# EasyEDA Pro project ProPrj_初级项目_2026-01-11.epro, board PCB2
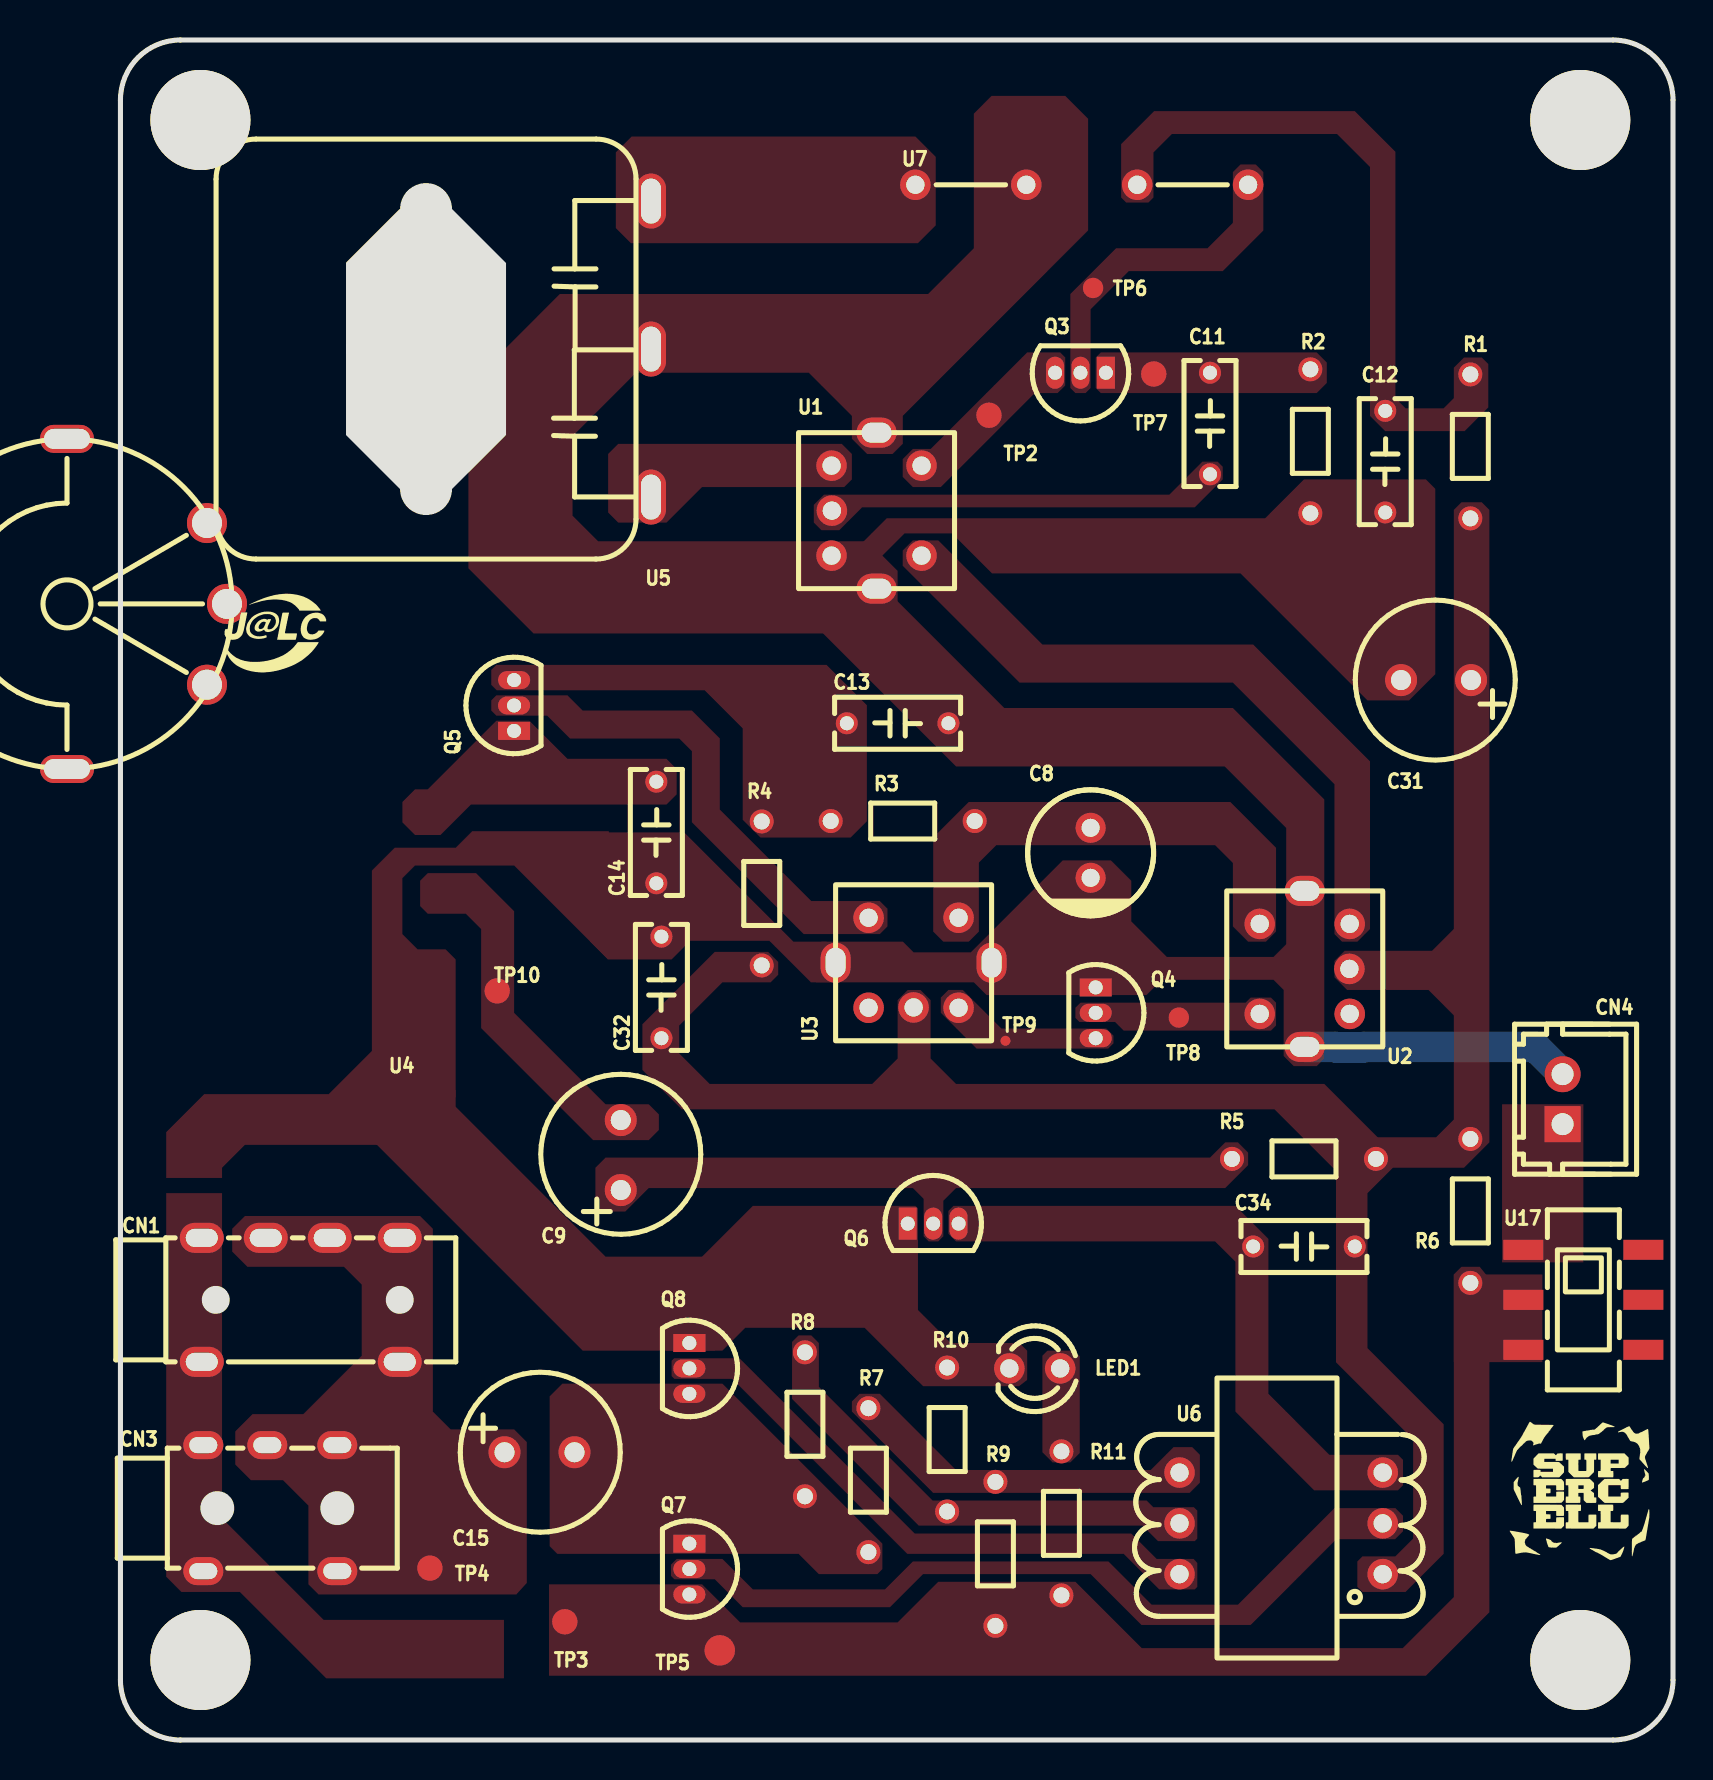
[diagram p6: board, top side]
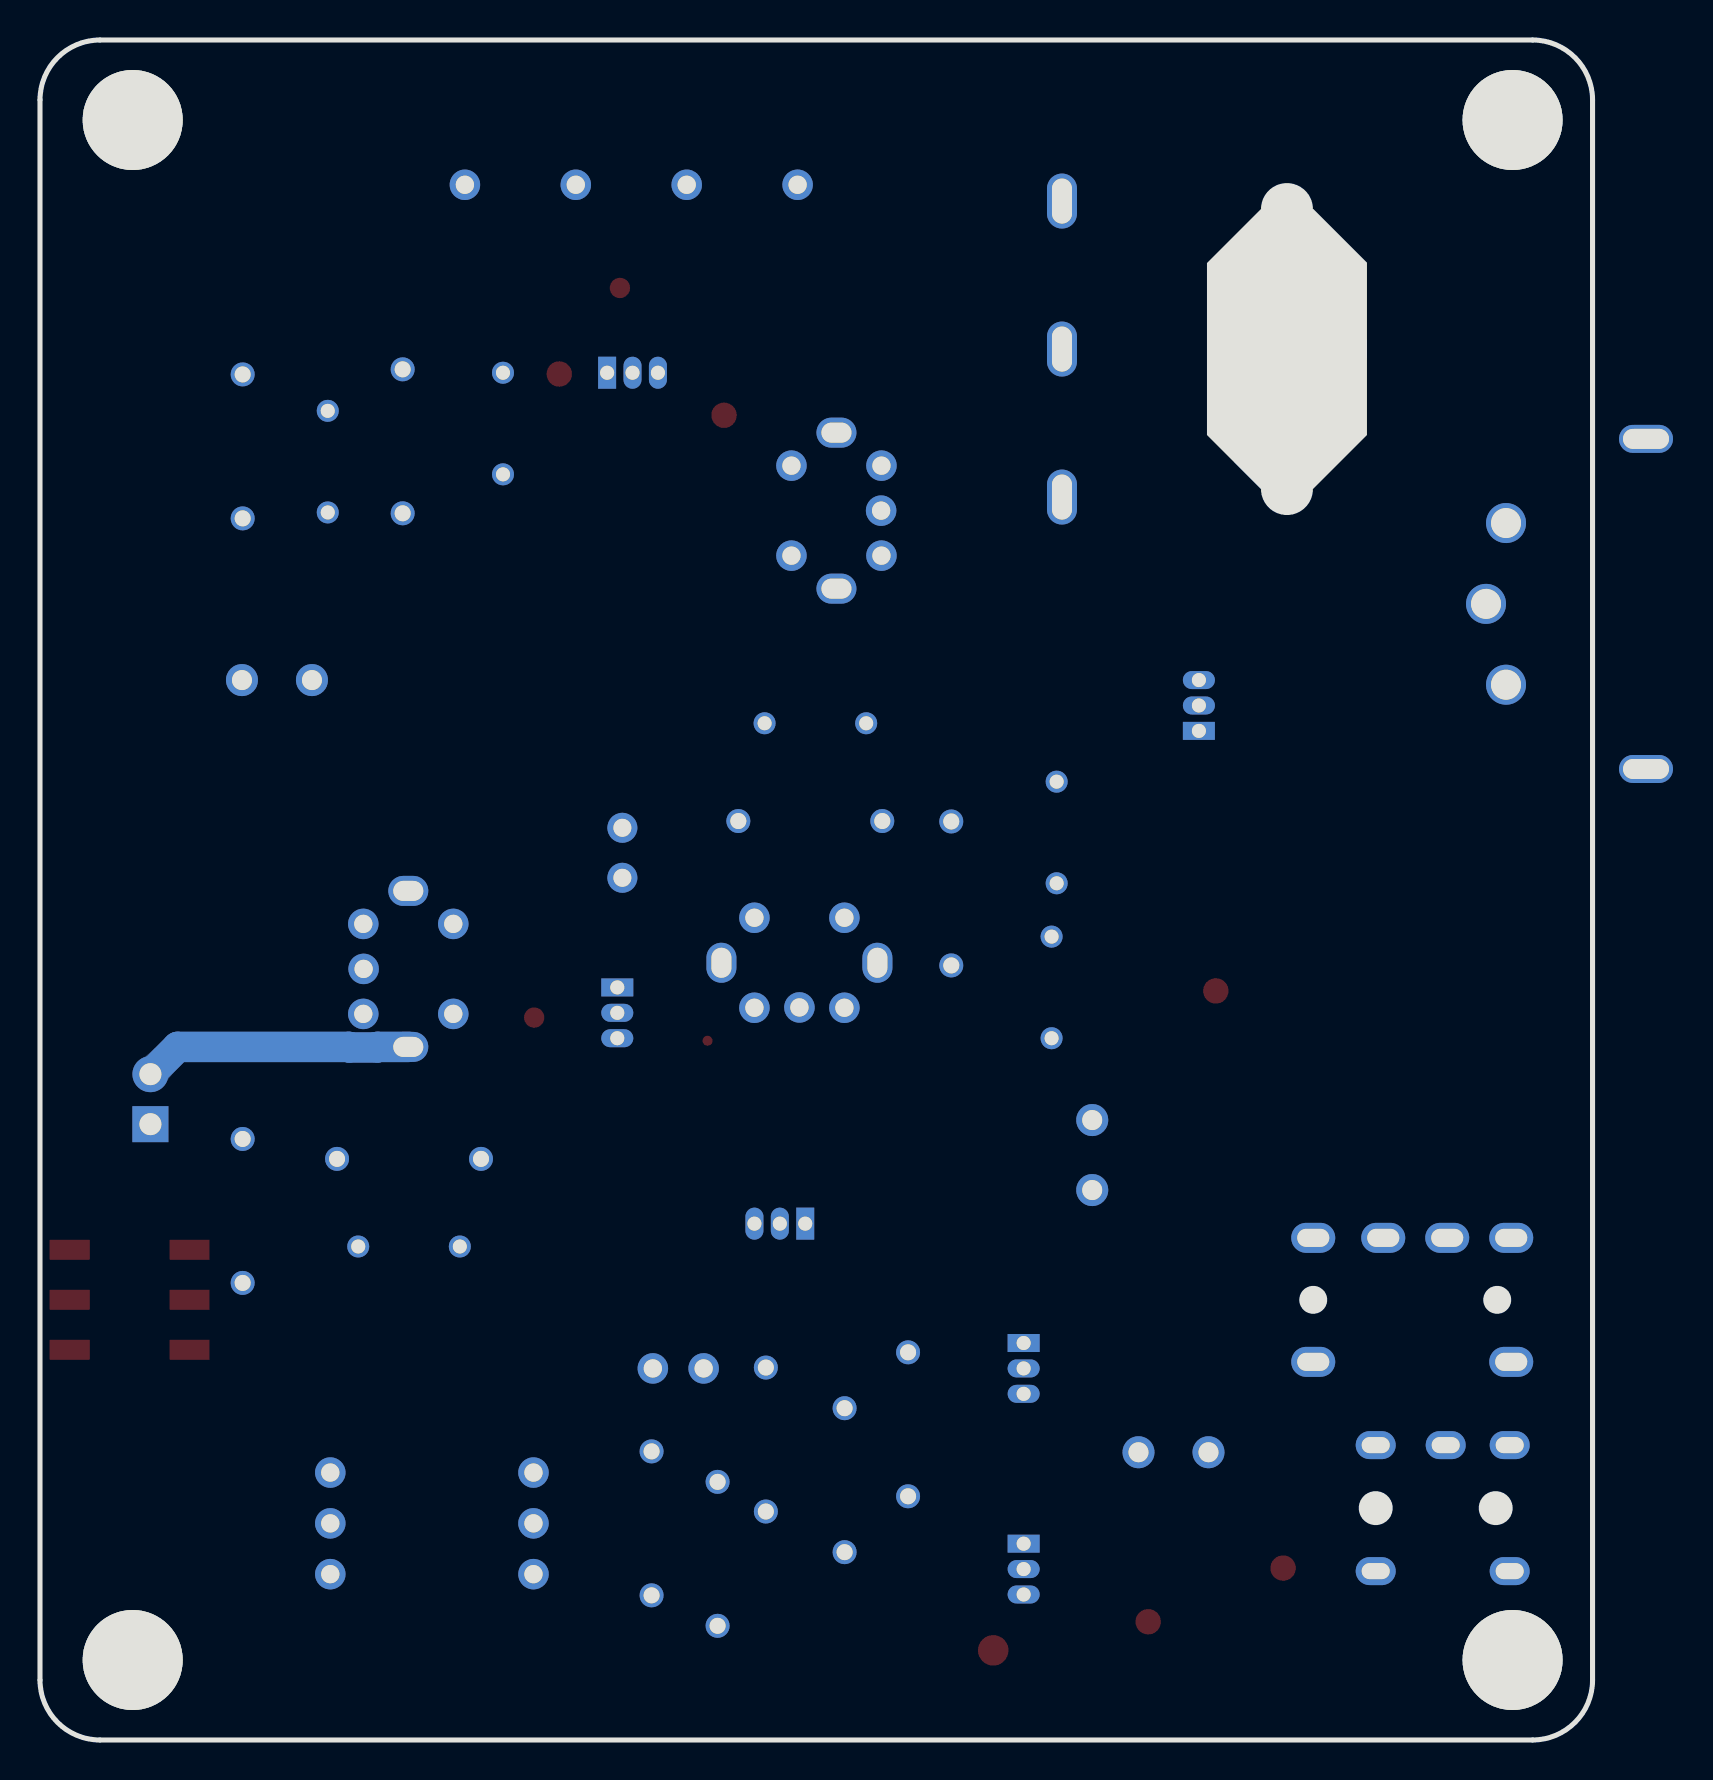
[diagram p7: board, bottom side, seen from below]

Outline 77.63 x 85 mm; copper layers: Top Layer, Bottom Layer. Coordinates in mm from the lower left corner of the outline.
Outline path: 0,82 arc(0.88,84.12) 3,85 74.63,85 arc(76.76,84.12) 77.63,82 77.63,3 arc(76.76,0.88) 74.63,0 3,0 arc(0.88,0.88) 0,3 0,82
Stack: Top Layer 0.035mm / Dielectric1 1.51mm FR4 er 4.5 / Bottom Layer 0.035mm

## Design rules (mm)
template: 自定义配置
spacing copperThickness1oz (default): track to track 0.102, other pairs 0 to 0.3
spacing copperThickness2oz: track to track 0.203, other pairs 0.152 to 0.3
track width copperThickness1oz (default): min 0.127, default 0.254, max 2.54
track width copperThickness2oz: min 0.203, default 0.254, max 2.54
differential pair differentialPair (default): width min 0.127, default 0.254, max 2.54; gap min 0.152, default 0.152
via viaSize (default): diameter min 0.5, default 0.61, max 10; hole min 0.3, default 0.305, max 6.3

## Placement (name value [footprint] x y rotation side)
C8  10uF  [CAP-TH_BD6.3-P2.50-D0.5-FD]  48.51 44.36 270 top
C9  4.7uF  [CAP-TH_BD8.0-P3.50-D0.5-FD_3]  25.02 29.25 90 top
C11  6.8nF  [CAP-TH_L6.3-W2.6-P5.08-D0.5]  54.48 65.82 90 top
C12  10nF  [CAP-TH_L6.3-W2.6-P5.08-D0.5]  63.25 63.92 90 top
C13  22nF  [CAP-TH_L6.3-W2.6-P5.08-D0.5]  38.86 50.84 180 top
C14  22nF  [CAP-TH_L6.3-W2.6-P5.08-D0.5]  26.8 45.38 90 top
C15  4.7uF  [CAP-TH_BD8.0-P3.50-D0.5-FD_3]  20.96 14.39 0 top
C31  4.7uF  [CAP-TH_BD8.0-P3.50-D0.5-FD_3]  65.79 53 180 top
C32  22nF  [CAP-TH_L6.3-W2.6-P5.08-D0.5]  27.05 37.63 90 top
C34  22nF  [CAP-TH_L6.3-W2.6-P5.08-D0.5]  59.18 24.67 180 top
CN1  PJ-313B6-B  [AUDIO-TH_PJ-313B6-B]  9.02 22.01 0 top
CN3  PJ-313 5JCJ  [AUDIO-TH_PJ-313_5JCJ]  7.49 11.59 0 top
CN4  ZX-XH2.54-2PZZ  [CONN-TH_2P-P2.50_HX25003-2A]  72.11 32.04 90 top
LED1  -  [LED_TH-3mm]  45.72 18.58 180 top
Q3  -  [S8050_TO_92]  48.01 68.36 180 top
Q4  -  [S8050_TO_92]  48.77 36.36 270 top
Q5  -  [S8050_TO_92]  19.69 51.73 90 top
Q6  -  [S8050_TO_92]  40.64 25.82 0 top
Q7  -  [S8050_TO_92]  28.45 8.55 270 top
Q8  -  [S8050_TO_92]  28.45 18.58 270 top
R1  200K  [Res_1/8W]  67.44 64.68 270 top
R2  10kΩ  [Res_1/8W]  59.56 64.93 90 top
R3  120K  [Res_1/8W]  39.12 46.01 180 top
R4  30K  [Res_1/8W]  32 42.33 270 top
R5  30K  [Res_1/8W]  59.18 28.99 0 top
R6  100  [Res_1/8W]  67.56 26.45 90 top
R7  100  [Res_1/8W]  37.34 12.99 270 top
R8  120  [Res_1/8W]  34.29 15.78 90 top
R9  120  [Res_1/8W]  43.81 9.31 90 top
R10  100  [Res_1/8W]  41.4 15.02 90 top
R11  10kΩ  [Res_1/8W]  46.99 10.83 270 top
TP2  -  [Test-Point-0.5mm#2]  43.43 66.24 0 top
TP3  -  [Test-Point-0.5mm#2]  22.22 5.91 0 top
TP4  -  [Test-Point-0.5mm#2]  15.47 8.59 0 top
TP5  -  [Test-Point-0.5mm]  29.97 4.48 0 top
TP6  -  [Test-Point-0.5mm#3]  48.64 72.6 0 top
TP7  -  [Test-Point-0.5mm#2]  51.67 68.3 0 top
TP8  -  [Test-Point-0.5mm#3]  52.92 36.12 0 top
TP9  -  [Test-Point-0.5mm#4]  44.25 34.96 0 top
TP10  -  [Test-Point-0.5mm#2]  18.84 37.45 0 top
U1  -  [白色中周电感]  33.91 57.57 0 top
U2  -  [白色中周电感]  63.12 42.45 180 top
U3  -  [白色中周电感]  43.56 34.96 90 top
U4  -  [旋转电位器]  8.25 42.45 90 top
U5  -  [可变电容]  25.78 80.05 180 top
U6  -  [蓝色变压器]  63.12 13.37 180 top
U7  -  [天线变压器]  34.93 70.39 0 top
U17  YSSP2AG00  [SW-SMD_YSSP2AG00]  73.15 22.01 270 top
U18  -  [固定孔]  4 4 0 top
U19  -  [固定孔]  73 4 0 top
U20  -  [固定孔]  4 81 0 top
U21  -  [固定孔]  73 81 0 top

## Footprints (pads in the part's own frame, mm; a bottom-side part is the same pattern mirrored in y, then rotated)
AUDIO-TH_PJ-313_5JCJ
  oval 2x1.4 hole 1.4x0.8: 1(-3.35,3.15) 1(-3.35,-3.15) 2(3.35,3.15) 2(3.35,-3.15) 3(-0.15,3.15)
AUDIO-TH_PJ-313B6-B
  oval 2.2x1.5 hole 1.6x0.9: 1(-4.95,3.1) 1(-4.95,-3.1) 2(-1.75,3.1) 3(1.45,3.1) 4(4.95,3.1) 4(4.95,-3.1)
CAP-TH_BD6.3-P2.50-D0.5-FD
  round 1.5 hole 0.9: 1(-1.25,0) 2(1.25,0)
CAP-TH_BD8.0-P3.50-D0.5-FD_3
  round 1.6 hole 1: 1(-1.75,0) 2(1.75,0)
CAP-TH_L6.3-W2.6-P5.08-D0.5
  round 1.1 hole 0.7: 1(-2.54,0) 2(2.54,0)
CONN-TH_2P-P2.50_HX25003-2A
  rect 1.8x1.8 hole 1.1: 1(-1.25,0)
  round 1.8 hole 1.1: 2(1.25,0)
LED_TH-3mm
  round 1.524 hole 0.914: 1(-1.27,0) 2(1.27,0)
Res_1/8W
  round 1.199 hole 0.8: 1(-3.599,0.063) 2(3.599,0.063)
S8050_TO_92
  rect 0.899x1.6 hole 0.701: 1(-1.27,0)
  oval 0.899x1.6 hole 0.701: 2(0,0) 3(1.27,0)
SW-SMD_YSSP2AG00
  rect 1x2 smd: 1(-2.5,3) 2(0,3) 3(2.5,3) 4(-2.5,-3) 5(0,-3) 6(2.5,-3)
Test-Point-0.5mm
  round 1.524 smd: 1(0,0)
Test-Point-0.5mm#2
  round 1.27 smd: 1(0,0)
Test-Point-0.5mm#3
  round 1.016 smd: 1(0,0)
Test-Point-0.5mm#4
  round 0.5 smd: 1(0,0)
可变电容
  oval 1.5x2.75 hole 1x2.25: 1(-0.75,17.9) 2(-0.75,10.5) 3(-0.75,3.1)
固定孔
  round 5 hole 5x3: 1(0,0)
天线变压器
  round 1.524 hole 0.914: 1(4.826,7.366) 2(10.371,7.366) 3(15.918,7.366) 4(21.463,7.366)
旋转电位器
  round 2 hole 1.5: 1(10.309,3.928) 2(14.351,2.928) 3(18.392,3.928)
  oval 1.4x2.7 hole 1x2.3: 4(22.601,10.928) 5(6.096,10.928)
白色中周电感
  round 1.524 hole 0.914: 1(1.65,6.15) 2(1.666,3.9) 3(1.65,1.65) 4(6.15,1.65) 5(6.15,6.15)
  oval 2x1.5 hole 1.5x1: 6(3.9,7.8) 7(3.9,0)
蓝色变压器
  round 1.524 hole 0.914: 1(0,5.08) 2(0,2.54) 3(0,0) 4(10.16,0) 5(10.16,2.54) 6(10.16,5.08)

## Nets
As in the schematic.

Pads without a net: U2 1; U3 1; U4 4 5; U17 1 2 3; U18 1; U19 1; U20 1; U21 1

## Routing (per net, layer and track width the routed paths; a pad name or vN(x,y) marks a point on that pad's centre or on a via; arc(x,y) is an arc through that point)
GND: length 13.5
  Bottom Layer w1.524: U2.6 60.75,34.66 60.78,34.63 62.16,34.63 62.19,34.66 70.75,34.66 CN4.2

## Copper pours and planes (outline as drawn; the poured copper is in the pictures)
GND on Top Layer: 12.38,32.48 30.1,32.48 30.1,19.47 12.38,19.47
GND on Top Layer: 36.83,63.03 65.75,63.03 65.75,51.98 36.83,51.98
GND on Top Layer: 39.25,19.85 45.34,19.85 45.34,17.69 39.25,17.69
GND on Top Layer: 17.4,82.21 48.39,82.21 48.39,55.33 17.4,55.33
GND on Top Layer: 2.29,45.44 24.42,45.44 24.42,28.1 2.29,28.1
GND on Top Layer: 2.29,27.34 19.18,27.34 19.18,3.09 2.29,3.09
GND on Top Layer: 23.5,45.38 35.56,45.38 35.56,37.88 23.5,37.88
GND on Top Layer: 26.16,26.71 42.04,26.71 42.04,17.94 26.16,17.94
GND on Top Layer: 34.42,57.19 60.2,57.19 60.2,33.69 34.42,33.69
VCC3V on Top Layer: 21.43,23.66 68.45,23.66 68.45,3.21 21.43,3.21
VCC3V on Top Layer: 66.68,23.28 71.1,23.28 71.1,18.89 66.68,18.89
$1N522 on Top Layer: 50.04,81.44 68.4,81.44 68.4,65.44 50.04,65.44
$1N636 on Top Layer: 48.77,69.38 60.32,69.38 60.32,67.35 48.77,67.35
$1N689 on Top Layer: 24.77,80.17 40.77,80.17 40.77,74.84 24.77,74.84
$1N786 on Top Layer: 39.12,69.38 47.24,69.38 47.24,62.65 39.12,62.65
$1N792 on Top Layer: 34.67,63.92 55.12,63.92 55.12,60.49 34.67,60.49
$1N797 on Top Layer: 24.38,64.81 36.58,64.81 36.58,60.87 24.38,60.87
$1N848 on Top Layer: 39.12,59.98 62.48,59.98 62.48,39.92 39.12,39.92
$1N916 on Top Layer: 47.75,37.12 57.78,37.12 57.78,35.47 47.75,35.47
$1N1155 on Top Layer: 26.1,39.41 62.99,39.41 62.99,28.11 26.1,28.11
$1N1155 on Top Layer: 60.71,40.8 66.93,40.8 66.93,35.98 60.71,35.98
$1N1155 on Top Layer: 37.47,37.5 41.91,37.5 41.91,32.68 37.47,32.68
$1N1155 on Top Layer: 60.78,61.89 68.45,61.89 68.45,7.4 60.78,7.4
$1N1208 on Top Layer: 40.64,46.9 57.78,46.9 57.78,39.92 40.64,39.92
$1N1326 on Top Layer: 18.54,52.23 38.35,52.23 38.35,40.3 18.54,40.3
$1N1392 on Top Layer: 18.54,53.76 37.33,53.76 37.33,45.12 18.54,45.12
$1N1897 on Top Layer: 14.1,50.96 27.81,50.96 27.81,45.25 14.1,45.25
$1N1955 on Top Layer: 14.99,43.34 26.92,43.34 26.92,29.99 14.99,29.99
$1N2056 on Top Layer: 23.75,29.88 56.39,29.88 56.39,24.93 23.75,24.93
$1N2264 on Top Layer: 41.4,26.71 64.13,26.71 64.13,12.48 41.4,12.48
$1N2871 on Top Layer: 21.46,17.82 38.1,17.82 38.1,8.29 21.46,8.29
$1N2875 on Top Layer: 27.53,11.59 64.13,11.59 64.13,5.75 27.53,5.75
$1N2990 on Top Layer: 36.58,17.31 53.97,17.31 53.97,12.36 36.58,12.36
$1N3009 on Top Layer: 27.56,19.09 53.85,19.09 53.85,7.53 27.56,7.53
$1N3161 on Top Layer: 33.58,20.23 53.85,20.23 53.85,9.94 33.58,9.94
$1N4036 on Top Layer: 5.59,26.2 20.32,26.2 20.32,7.28 5.59,7.28
$1N4900 on Top Layer: 41.02,37.5 49.66,37.5 49.66,34.57 41.02,34.57
$1N4979 on Top Layer: 47.5,78.78 57.15,78.78 57.15,67.35 47.5,67.35
$1N9264 on Top Layer: 46.1,19.47 47.97,19.47 47.97,13.88 46.1,13.88
$1N9795 on Top Layer: 69.09,31.79 73.15,31.79 73.15,23.88 69.09,23.88

Small or netless copper shapes (teardrops, artwork), in the pictures only: 1 on Bottom Layer
